# Altium project GSM_Valve_Arduino_Nano_V1R1.PrjPcb
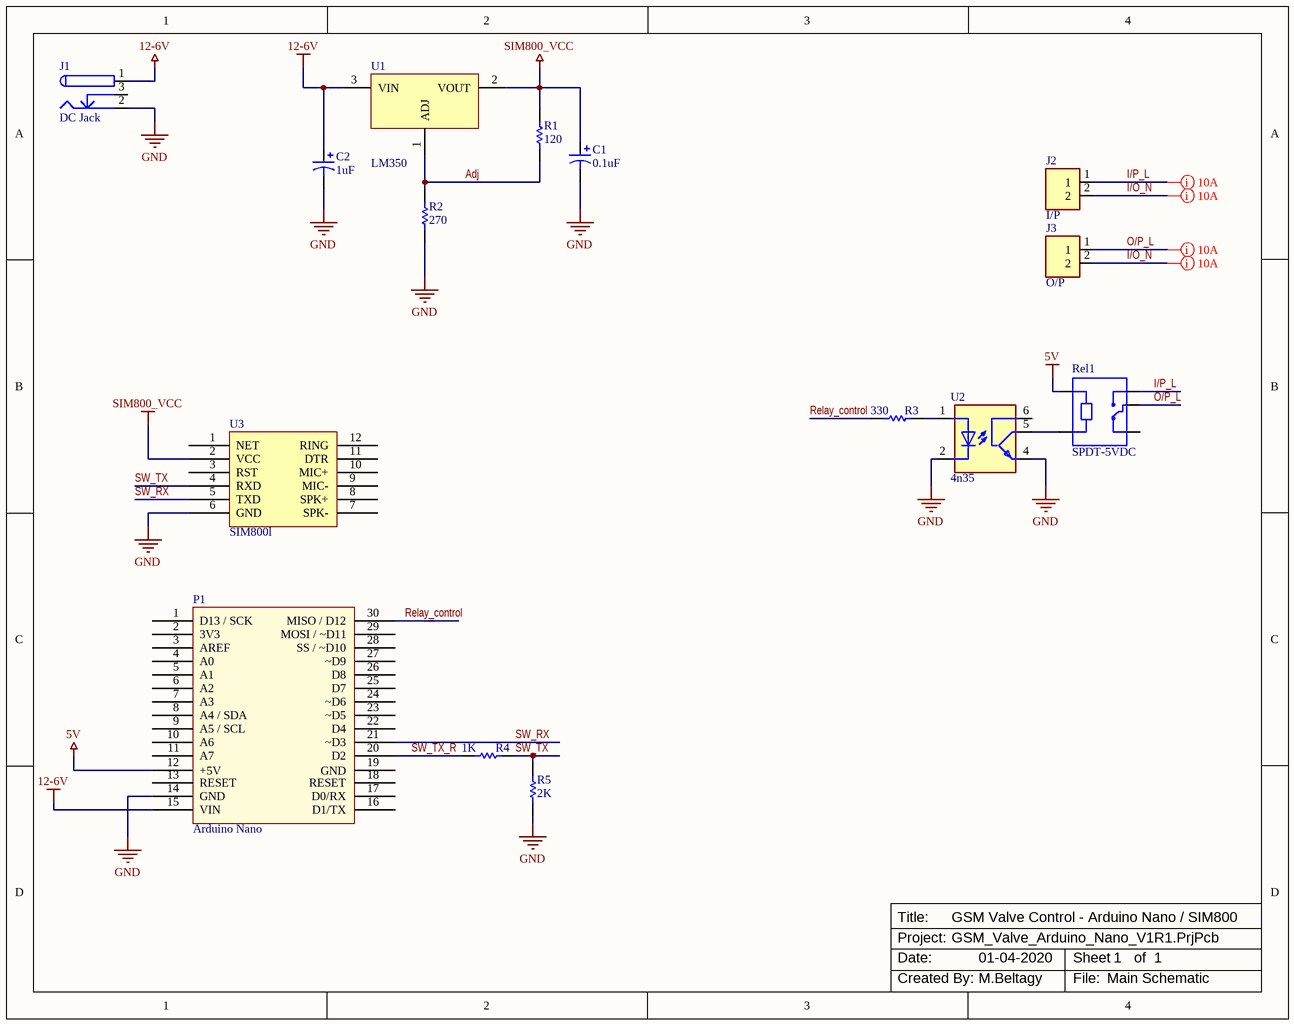
[diagram p0: Sheet1.SchDoc]
1 sheet, 15 parts. Net scope: global (net labels, ports and power ports of the same name join across sheets).
Board file: PCB.PcbDoc

## Sheet Sheet1.SchDoc: GSM Valve Control - Arduino Nano / SIM800
size A; Date: 01-04-2020; Author: M.Beltagy; CompanyName: El-Warsha; DocumentNumber: 1; SheetNumber: 1; SheetTotal: 1; CurrentDate: 01-04-2020; DocumentName: Main Schematic

### Parts
C1  0.1uF  [R38]
C2  1uF  [R38]
J1  DC Jack  [DC Jack - KLDHCX]
J2  I/P  [Terminal Block - 2]
J3  O/P  [Terminal Block - 2]
P1  Arduino Nano  [Arduino Nano]
R1  120  [AXIAL-0.5]
R2  270  [AXIAL-0.5]
R3  330  [AXIAL-0.5]
R4  1K  [AXIAL-0.5]
R5  2K  [AXIAL-0.5]
Rel1  SPDT-5VDC  [SRD-5VDC]
U1  LM350  [TO254P1054X470X1955-3]
U2  4n35  [DIP6]
U3  SIM800l  [SIM800l]

### Nets
5V: P1.12(+5V) Rel1.A1
12-6V: C2.1 J1.1 P1.15(VIN) U1.3(VIN)
GND: C1.2 C2.2 J1.2 P1.14(GND) R2.1 R5.1 U2.2(C) U2.4(EMI) U3.6(GND)
SIM800_VCC: C1.1 R1.2 U1.2(VOUT) U3.2(VCC)
Adj: R1.1 R2.2 U1.1(ADJ)
I/O_N: J2.2 J3.2
I/P_L: J2.1 Rel1.NO
O/P_L: J3.1 Rel1.COM
Relay_control: P1.30(MISO_/_D12) R3.1
SW_RX: P1.21(~D3) U3.5(TXD)
SW_TX: R4.2 R5.2 U3.4(RXD)
SW_TX_R: P1.20(D2) R4.1
NetR3_2: R3.2 U2.1(A)
NetRel1_A2: Rel1.A2 U2.5(COL)

Not connected (* = marked no-connect by the designer): J1 3; P1 1(D13_/_SCK) 2(3V3) 3(AREF) 4(A0) 5(A1) 6(A2) 7(A3) 8(A4_/_SDA) 9(A5_/_SCL) 10(A6) 11(A7) 13(RESET) 16(D1/TX) 17(D0/RX) 18(RESET) 19(GND) 22(D4) 23(~D5) 24(~D6) 25(D7) 26(D8) 27(~D9) 28(SS_/_~D10) 29(MOSI_/_~D11); Rel1 NC; U2 6(BAS); U3 1(NET) 3(RST) 7(SPK-) 8(SPK+) 9(MIC-) 10(MIC+) 11(DTR) 12(RING)

### Layout directives
rule Width Constraint [Pref Width = 145mil    Min Width = 10mil    Max Width = 148mil]: I/O_N, I/P_L, O/P_L

### Notes on the sheet
- Title:
- Date:
- Created By:
- Project:
- Sheet
- File:
- of

### Library data of the parts
C1 C2 = Cap Pol1: Polarized Capacitor (Radial); Published: 8-Jun-2000; LatestRevisionDate: 17-Jul-2002; LatestRevisionNote: Re-released for DXP Platform.; PackageReference: RB7.6-15; Publisher: Altium Limited; PackageDescription: Polarized Capacitor (Radial); 2 Leads
  C1: Value: 0.1uF
  C2: Value: 1uF
J1 = DC Jack: Manufacturer: Kycon; Manufacturer Part Number: KLDHCX-0202-AC-1; Rating: 5A - 50VDC; Supplier Part Number 1: 806-KLDHCX-0202-AC-1
J2 J3 = TBP01P1-508-02BE: Terminal Block - 2 Positions; Manufacturer: CUI; Rating: 5A; Manufacturer Part Number: TBP01P1-508-02BE; Supplier Part Number 1: 102-6390-ND
R1 = Res Semi: Semiconductor Resistor; Rating: 0.25 W; Value: 120 O
R2 = Res Semi: Semiconductor Resistor; Rating: 0.25 W; Value: 270 O
R3 = Res Semi: Semiconductor Resistor; Rating: 0.25 W; Value: 330 O
R4 = Res Semi: Semiconductor Resistor; Rating: 0.25 W; Value: 1K O
R5 = Res Semi: Semiconductor Resistor; Rating: 0.25 W; Value: 2K O
Rel1 = Relay-SRD-5VDC: Rating: 5VDC - 250VAC/10A
U1 = LM350: Manufacturer: TI National Semiconductor; Manufacturer Part Number: LM350AT/NOPB; Output Voltage: 1.2V to 33V; Maximum Output Current: 3A; Maximum Power Dissipation: 25000mW; Number of Outputs: 1; Reference Voltage: 1.262V; Junction to Ambient: 50C/W(Typ); Junction to Case: 4C/W; Screening Level: Extended; Pin_Count: 3; Product Width: 4.7mm(Max); Polarity: Positive; Product Height: 8.89mm(Max); Product Length: 10.16mm; Output Type: Adjustable; Accuracy: 1%; Function: Standard; Line Regulation: 0.01%/V; Load Regulation: 0.3%; Supplier Part Number 1: LM350AT/NOPB-ND; Supplier 1: Digi-Key; Stock 1: 2711; Pricing 1: 1=3.1, 10=2.785, 25=2.6324, 100=2.1645, 250=1.9422, 500=1.872, 1000=1.5561, 2500=1.4976, 5000=1.4508 (USD); Family: LM350A; Type: Linear; Minimum Operating Temperature: -40C; Maximum Operating Temperature: 125C; Mounting: Through Hole; Packaging: Rail; Supplier_Package: TO-220; Product Type: Linear Regulator; ComponentLink1URL: http://www.ti.com/lit/gpn/lm350a?src-supplier=Mouser; ComponentLink1Description: http://www.ti.com/lit/gpn/lm350a?src-supplier=Mouser; ComponentLink2URL: http://www.ti.com/general/docs/lit/getliterature.tsp?genericPartNumber=LM350A&&fileType=pdf&src-supplier=Avnet; ComponentLink2Description: http://www.ti.com/general/docs/lit/getliterature.tsp?genericPartNumber=LM350A&&fileType=pdf&src-supplier=Avnet; ComponentLink3URL: http://www.jameco.com/Jameco/Products/ProdDS/838946.pdf?src-supplier=Jameco; ComponentLink3Description: http://www.jameco.com/Jameco/Products/ProdDS/838946.pdf?src-supplier=Jameco; ComponentLink4URL: http://www.produktinfo.conrad.com/datenblaetter/1000000-1099999/001014081-da-01-en-IC_REG_LDO_ADJ_LM350AT_NOPB_TO_220_3_TID.pdf?src-supplier=Conrad; ComponentLink4Description: http://www.produktinfo.conrad.com/datenblaetter/1000000-1099999/001014081-da-01-en-IC_REG_LDO_ADJ_LM350AT_NOPB_TO_220_3_TID.pdf?src-supplier=Conrad
U2 = 4N35: EVERLIGHT         4N35             Transistor Output Optocoupler, 1 Channel, 5 kV, 100 %, 60 mA, DIP, 6 Pins; Manufacturer: Everlight; Manufacturer Part Number: 4N35; Supplier Part Number 1: 4N35EL-ND
U3 = SIM800l: Manufacturer Part Number: SIM800l Breakout; Rating: 3.4~4.4VDC / 2A
P1 = Arduino Nano: Manufacturer: Arduino; Manufacturer Part Number: Arduino Nano